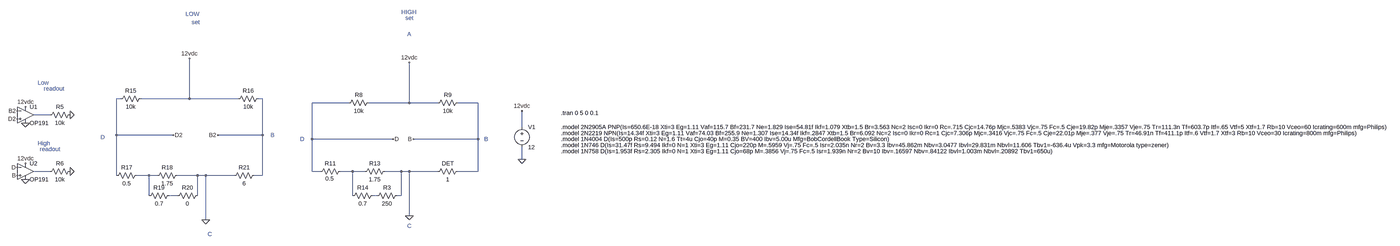
[diagram p0: schematic WheatstoneBridgeAlternative.asc, whole sheet]
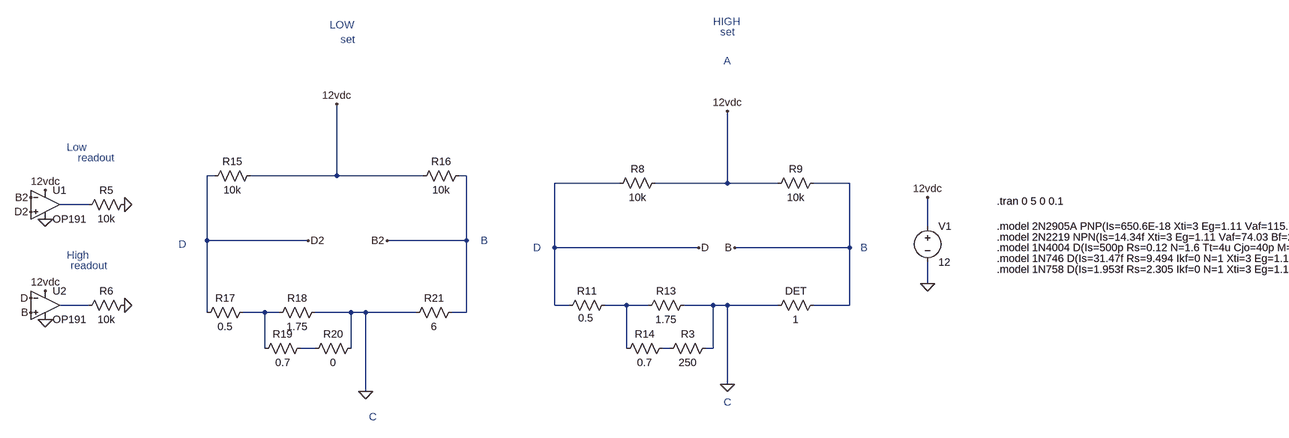
[diagram p1: schematic WheatstoneBridgeAlternative.asc, part, row 1 of 1, column 1 of 2]
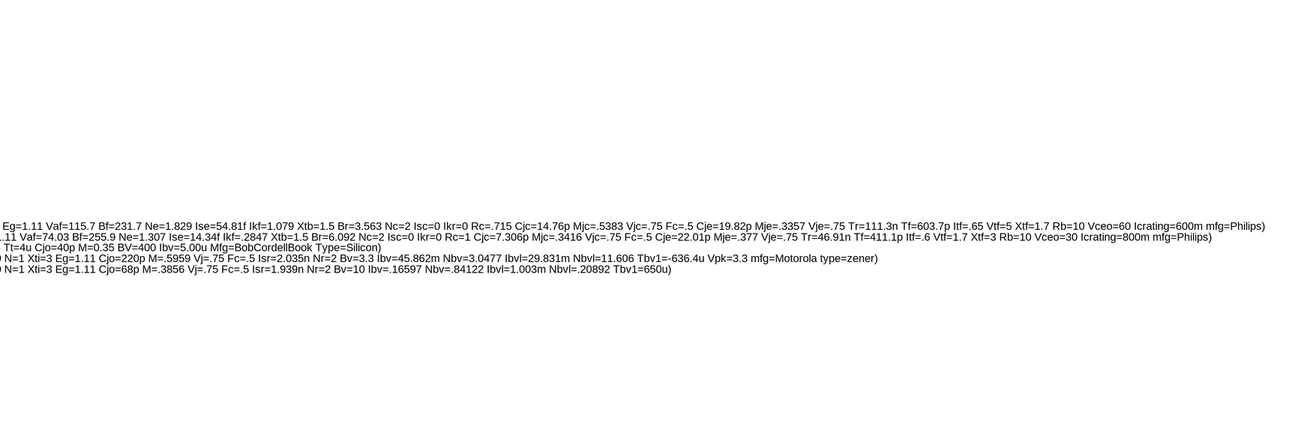
[diagram p2: schematic WheatstoneBridgeAlternative.asc, part, row 1 of 1, column 2 of 2]
WheatstoneBridgeAlternative.asc, the LTspice schematic file:
Version 4
SHEET 1 3972 2628
WIRE -3920 -720 -3936 -720
WIRE -3648 -720 -3648 -880
WIRE -3648 -720 -3840 -720
WIRE -3456 -720 -3648 -720
WIRE -3360 -720 -3376 -720
WIRE -2928 -704 -3072 -704
WIRE -2688 -704 -2688 -864
WIRE -2688 -704 -2848 -704
WIRE -2576 -704 -2688 -704
WIRE -2416 -704 -2496 -704
WIRE -4400 -656 -4464 -656
WIRE -1888 -608 -1888 -672
WIRE -3936 -576 -3936 -720
WIRE -3712 -576 -3936 -576
WIRE -3360 -576 -3360 -720
WIRE -3360 -576 -3536 -576
WIRE -3072 -560 -3072 -704
WIRE -2752 -560 -3072 -560
WIRE -2416 -560 -2416 -704
WIRE -2416 -560 -2672 -560
WIRE -1888 -480 -1888 -528
WIRE -4400 -432 -4464 -432
WIRE -3072 -432 -3072 -560
WIRE -3040 -432 -3072 -432
WIRE -2912 -432 -2960 -432
WIRE -2864 -432 -2912 -432
WIRE -2720 -432 -2784 -432
WIRE -2688 -432 -2720 -432
WIRE -2576 -432 -2688 -432
WIRE -2416 -432 -2416 -560
WIRE -2416 -432 -2496 -432
WIRE -3936 -416 -3936 -576
WIRE -3808 -416 -3856 -416
WIRE -3776 -416 -3808 -416
WIRE -3616 -416 -3696 -416
WIRE -3584 -416 -3616 -416
WIRE -3472 -416 -3584 -416
WIRE -3360 -416 -3360 -576
WIRE -3360 -416 -3392 -416
WIRE -3808 -336 -3808 -416
WIRE -3696 -336 -3728 -336
WIRE -3616 -336 -3616 -416
WIRE -2912 -336 -2912 -432
WIRE -2816 -336 -2832 -336
WIRE -2720 -336 -2720 -432
WIRE -2720 -336 -2736 -336
WIRE -2688 -256 -2688 -432
WIRE -3584 -240 -3584 -416
FLAG -1888 -672 12vdc
FLAG -1888 -480 0
FLAG -2688 -256 0
FLAG -2688 -864 12vdc
FLAG -2752 -560 D
FLAG -2672 -560 B
FLAG -3648 -880 12vdc
FLAG -3584 -240 0
FLAG -3712 -576 D2
FLAG -3536 -576 B2
FLAG -4496 -688 12vdc
FLAG -4496 -624 0
FLAG -4528 -672 B2
FLAG -4528 -640 D2
FLAG -4496 -464 12vdc
FLAG -4496 -400 0
FLAG -4528 -448 D
FLAG -4528 -416 B
FLAG -4320 -656 0
FLAG -4320 -432 0
SYMBOL voltage -1888 -624 R0
WINDOW 123 0 0 Left 0
WINDOW 39 0 0 Left 0
SYMATTR InstName V1
SYMATTR Value 12
SYMBOL res -2832 -720 R90
WINDOW 0 0 56 VBottom 2
WINDOW 3 32 56 VTop 2
SYMATTR InstName R8
SYMATTR Value 10k
SYMBOL res -2480 -720 R90
WINDOW 0 0 56 VBottom 2
WINDOW 3 32 56 VTop 2
SYMATTR InstName R9
SYMATTR Value 10k
SYMBOL res -2480 -448 R90
WINDOW 0 0 56 VBottom 2
WINDOW 3 32 56 VTop 2
SYMATTR InstName DET
SYMATTR Value 1
SYMBOL res -2944 -448 R90
WINDOW 0 0 56 VBottom 2
WINDOW 3 29 59 VTop 2
SYMATTR InstName R11
SYMATTR Value 0.5
SYMBOL res -2768 -448 R90
WINDOW 0 0 56 VBottom 2
WINDOW 3 32 56 VTop 2
SYMATTR InstName R13
SYMATTR Value 1.75
SYMBOL res -2816 -352 R90
WINDOW 0 0 56 VBottom 2
WINDOW 3 32 56 VTop 2
SYMATTR InstName R14
SYMATTR Value 0.7
SYMBOL res -2720 -352 R90
WINDOW 0 0 56 VBottom 2
WINDOW 3 32 56 VTop 2
SYMATTR InstName R3
SYMATTR Value 250
SYMBOL res -3824 -736 R90
WINDOW 0 0 56 VBottom 2
WINDOW 3 32 56 VTop 2
SYMATTR InstName R15
SYMATTR Value 10k
SYMBOL res -3360 -736 R90
WINDOW 0 0 56 VBottom 2
WINDOW 3 32 56 VTop 2
SYMATTR InstName R16
SYMATTR Value 10k
SYMBOL res -3840 -432 R90
WINDOW 0 0 56 VBottom 2
WINDOW 3 32 56 VTop 2
SYMATTR InstName R17
SYMATTR Value 0.5
SYMBOL res -3680 -432 R90
WINDOW 0 0 56 VBottom 2
WINDOW 3 32 56 VTop 2
SYMATTR InstName R18
SYMATTR Value 1.75
SYMBOL res -3712 -352 R90
WINDOW 0 0 56 VBottom 2
WINDOW 3 32 56 VTop 2
SYMATTR InstName R19
SYMATTR Value 0.7
SYMBOL res -3600 -352 R90
WINDOW 0 0 56 VBottom 2
WINDOW 3 32 56 VTop 2
SYMATTR InstName R20
SYMATTR Value 0
SYMBOL res -3376 -432 R90
WINDOW 0 0 56 VBottom 2
WINDOW 3 32 56 VTop 2
SYMATTR InstName R21
SYMATTR Value 6
SYMBOL OpAmps\\OP191 -4496 -720 R0
SYMATTR InstName U1
SYMBOL OpAmps\\OP191 -4496 -496 R0
SYMATTR InstName U2
SYMBOL res -4304 -672 R90
WINDOW 0 0 56 VBottom 2
WINDOW 3 32 56 VTop 2
SYMATTR InstName R5
SYMATTR Value 10k
SYMBOL res -4304 -448 R90
WINDOW 0 0 56 VBottom 2
WINDOW 3 32 56 VTop 2
SYMATTR InstName R6
SYMATTR Value 10k
TEXT 328 -608 Left 2 !.model 2N2905A PNP(Is=650.6E-18 Xti=3 Eg=1.11 Vaf=115.7 Bf=231.7 Ne=1.829 Ise=54.81f Ikf=1.079 Xtb=1.5 Br=3.563 Nc=2 Isc=0 Ikr=0 Rc=.715 Cjc=14.76p Mjc=.5383 Vjc=.75 Fc=.5 Cje=19.82p Mje=.3357 Vje=.75 Tr=111.3n Tf=603.7p Itf=.65 Vtf=5 Xtf=1.7 Rb=10 Vceo=60 Icrating=600m mfg=Philips)
TEXT 328 -584 Left 2 !.model 2N2219 NPN(Is=14.34f Xti=3 Eg=1.11 Vaf=74.03 Bf=255.9 Ne=1.307 Ise=14.34f Ikf=.2847 Xtb=1.5 Br=6.092 Nc=2 Isc=0 Ikr=0 Rc=1 Cjc=7.306p Mjc=.3416 Vjc=.75 Fc=.5 Cje=22.01p Mje=.377 Vje=.75 Tr=46.91n Tf=411.1p Itf=.6 Vtf=1.7 Xtf=3 Rb=10 Vceo=30 Icrating=800m mfg=Philips)
TEXT 328 -560 Left 2 !.model 1N4004 D(Is=500p Rs=0.12 N=1.6 Tt=4u Cjo=40p M=0.35 BV=400 Ibv=5.00u Mfg=BobCordellBook Type=Silicon)
TEXT 328 -536 Left 2 !.model 1N746 D(Is=31.47f Rs=9.494 Ikf=0 N=1 Xti=3 Eg=1.11 Cjo=220p M=.5959 Vj=.75 Fc=.5 Isr=2.035n Nr=2 Bv=3.3 Ibv=45.862m Nbv=3.0477 Ibvl=29.831m Nbvl=11.606 Tbv1=-636.4u Vpk=3.3 mfg=Motorola type=zener)
TEXT 328 -512 Left 2 !.model 1N758 D(Is=1.953f Rs=2.305 Ikf=0 N=1 Xti=3 Eg=1.11 Cjo=68p M=.3856 Vj=.75 Fc=.5 Isr=1.939n Nr=2 Bv=10 Ibv=.16597 Nbv=.84122 Ibvl=1.003m Nbvl=.20892 Tbv1=650u)
TEXT 328 -664 Left 2 !.tran 0 5 0 0.1
TEXT -2696 -976 Left 2 ;A
TEXT -2696 -216 Left 2 ;C
TEXT -2392 -560 Left 2 ;B
TEXT -3120 -560 Left 2 ;D
TEXT -3664 -1056 Left 2 ;LOW
TEXT -2720 -1064 Left 2 ;HIGH
TEXT -4000 -568 Left 2 ;D
TEXT -3328 -576 Left 2 ;B
TEXT -3576 -184 Left 2 ;C
TEXT -4448 -544 Left 2 ;High
TEXT -4448 -784 Left 2 ;Low
TEXT -4424 -760 Left 2 ;readout
TEXT -4440 -520 Left 2 ;readout
TEXT -3640 -1024 Left 2 ;set
TEXT -2704 -1040 Left 2 ;set

The netlist it stands for:
* WheatstoneBridgeAlternative.asc
V1 12vdc 0 12
R8 12vdc D 10k
R9 B 12vdc 10k
R§DET B 0 1
R11 N003 D 0.5
R13 0 N003 1.75
R14 N006 N003 0.7
R3 0 N006 250
R15 12vdc D2 10k
R16 B2 12vdc 10k
R17 N004 D2 0.5
R18 0 N004 1.75
R19 N005 N004 0.7
R20 0 N005 0
R21 B2 0 6
XU1 D2 B2 12vdc 0 N001 OP191  ; pins In+ In- V+ V- OUT
XU2 B D 12vdc 0 N002 OP191  ; pins In+ In- V+ V- OUT
R5 0 N001 10k
R6 0 N002 10k
.model 2N2905A PNP(Is=650.6E-18 Xti=3 Eg=1.11 Vaf=115.7 Bf=231.7 Ne=1.829 Ise=54.81f Ikf=1.079 Xtb=1.5 Br=3.563 Nc=2 Isc=0 Ikr=0 Rc=.715 Cjc=14.76p Mjc=.5383 Vjc=.75 Fc=.5 Cje=19.82p Mje=.3357 Vje=.75 Tr=111.3n Tf=603.7p Itf=.65 Vtf=5 Xtf=1.7 Rb=10 Vceo=60 Icrating=600m mfg=Philips)
.model 2N2219 NPN(Is=14.34f Xti=3 Eg=1.11 Vaf=74.03 Bf=255.9 Ne=1.307 Ise=14.34f Ikf=.2847 Xtb=1.5 Br=6.092 Nc=2 Isc=0 Ikr=0 Rc=1 Cjc=7.306p Mjc=.3416 Vjc=.75 Fc=.5 Cje=22.01p Mje=.377 Vje=.75 Tr=46.91n Tf=411.1p Itf=.6 Vtf=1.7 Xtf=3 Rb=10 Vceo=30 Icrating=800m mfg=Philips)
.model 1N4004 D(Is=500p Rs=0.12 N=1.6 Tt=4u Cjo=40p M=0.35 BV=400 Ibv=5.00u Mfg=BobCordellBook Type=Silicon)
.model 1N746 D(Is=31.47f Rs=9.494 Ikf=0 N=1 Xti=3 Eg=1.11 Cjo=220p M=.5959 Vj=.75 Fc=.5 Isr=2.035n Nr=2 Bv=3.3 Ibv=45.862m Nbv=3.0477 Ibvl=29.831m Nbvl=11.606 Tbv1=-636.4u Vpk=3.3 mfg=Motorola type=zener)
.model 1N758 D(Is=1.953f Rs=2.305 Ikf=0 N=1 Xti=3 Eg=1.11 Cjo=68p M=.3856 Vj=.75 Fc=.5 Isr=1.939n Nr=2 Bv=10 Ibv=.16597 Nbv=.84122 Ibvl=1.003m Nbvl=.20892 Tbv1=650u)
.tran 0 5 0 0.1
* A
* C
* B
* D
* LOW
* HIGH
* D
* B
* C
* High
* Low
* readout
* readout
* set
* set
.lib ADI.lib
.backanno
.end